# EAGLE design Alarma2022 (EAGLE 7.2.0)
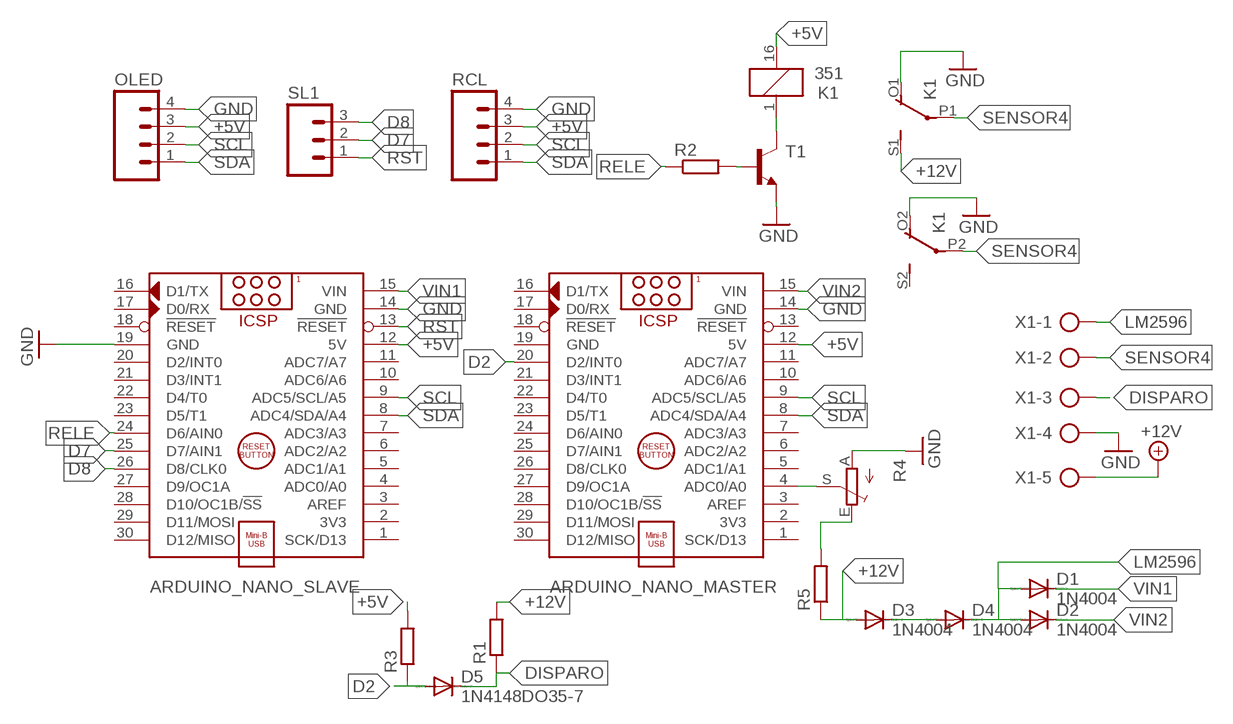
[diagram p0: schematic, sheet 1]

## Parts
ARDUINO_NANO_MASTER  ARDUINO_NANO  [ARDUINO_NANO]
ARDUINO_NANO_SLAVE  ARDUINO_NANO  [ARDUINO_NANO]
D1  1N4004  [DO41-10]
D2  1N4004  [DO41-10]
D3  1N4004  [DO41-10]
D4  1N4004  [DO41-10]
D5  1N4148DO35-7  [DO35-7]
K1  351  [351]
OLED  M04  [04P]
R1  R-EU_0207/10  [0207/10]
R2  R-EU_0207/10  [0207/10]
R3  R-EU_0207/10  [0207/10]
R4  TRIM_EU-B64Y  [B64Y]
R5  R-EU_0207/7  [0207/7]
RCL  M04  [04P]
SL1  M03  [03P]
T1  BC337-NPN-TO92-CBE  [TO92-CBE]
X1  AK500/5-H  [AK500/5-H]

## Nets
+5V: ARDUINO_NANO_MASTER.12(5V) ARDUINO_NANO_SLAVE.12(5V) K1.16 OLED.3 R3.2 RCL.3
+12V: D3.A K1.S1(2:S) R1.2 R5.1 X1.5
D2: ARDUINO_NANO_MASTER.20(D2/INT0) D5.A R3.1
D7: ARDUINO_NANO_SLAVE.25(D7/AIN1) SL1.2
D8: ARDUINO_NANO_SLAVE.26(D8/CLK0) SL1.3
DISPARO: D5.C R1.1 X1.3
GND: ARDUINO_NANO_MASTER.14(GND) ARDUINO_NANO_SLAVE.14(GND) ARDUINO_NANO_SLAVE.19(GND) K1.O1(2:O) K1.O2(3:O) OLED.4 R4.A RCL.4 T1.E X1.4
LM2596: D1.A D2.A D4.C X1.1
N$1: K1.1 T1.C
N$2: R2.2 T1.B
N$3: ARDUINO_NANO_MASTER.4(ADC0/A0) R4.S
N$4: R4.E R5.2
N$7: D3.C D4.A
RELE: ARDUINO_NANO_SLAVE.24(D6/AIN0) R2.1
RST: ARDUINO_NANO_SLAVE.13(!RESET) SL1.1
SCL: ARDUINO_NANO_MASTER.9(ADC5/SCL/A5) ARDUINO_NANO_SLAVE.9(ADC5/SCL/A5) OLED.2 RCL.2
SDA: ARDUINO_NANO_MASTER.8(ADC4/SDA/A4) ARDUINO_NANO_SLAVE.8(ADC4/SDA/A4) OLED.1 RCL.1
SENSOR4: K1.P1(2:P) K1.P2(3:P) X1.2
VIN1: ARDUINO_NANO_SLAVE.15(VIN) D1.C
VIN2: ARDUINO_NANO_MASTER.15(VIN) D2.C
Unconnected: ARDUINO_NANO_MASTER.1(SCK/D13) ARDUINO_NANO_MASTER.2(3V3) ARDUINO_NANO_MASTER.3(AREF) ARDUINO_NANO_MASTER.5(ADC1/A1) ARDUINO_NANO_MASTER.6(ADC2/A2) ARDUINO_NANO_MASTER.7(ADC3/A3) ARDUINO_NANO_MASTER.10(ADC6/A6) ARDUINO_NANO_MASTER.11(ADC7/A7) ARDUINO_NANO_MASTER.13(!RESET) ARDUINO_NANO_MASTER.16(D1/TX) ARDUINO_NANO_MASTER.17(D0/RX) ARDUINO_NANO_MASTER.18(!RESET) ARDUINO_NANO_MASTER.21(D3/INT1) ARDUINO_NANO_MASTER.22(D4/T0) ARDUINO_NANO_MASTER.23(D5/T1) ARDUINO_NANO_MASTER.24(D6/AIN0) ARDUINO_NANO_MASTER.25(D7/AIN1) ARDUINO_NANO_MASTER.26(D8/CLK0) ARDUINO_NANO_MASTER.27(D9/OC1A) ARDUINO_NANO_MASTER.28(D10/OC1B/!SS) ARDUINO_NANO_MASTER.29(D11/MOSI) ARDUINO_NANO_MASTER.30(D12/MISO) ARDUINO_NANO_SLAVE.1(SCK/D13) ARDUINO_NANO_SLAVE.2(3V3) ARDUINO_NANO_SLAVE.3(AREF) ARDUINO_NANO_SLAVE.4(ADC0/A0) ARDUINO_NANO_SLAVE.5(ADC1/A1) ARDUINO_NANO_SLAVE.6(ADC2/A2) ARDUINO_NANO_SLAVE.7(ADC3/A3) ARDUINO_NANO_SLAVE.10(ADC6/A6) ARDUINO_NANO_SLAVE.11(ADC7/A7) ARDUINO_NANO_SLAVE.16(D1/TX) ARDUINO_NANO_SLAVE.17(D0/RX) ARDUINO_NANO_SLAVE.18(!RESET) ARDUINO_NANO_SLAVE.20(D2/INT0) ARDUINO_NANO_SLAVE.21(D3/INT1) ARDUINO_NANO_SLAVE.22(D4/T0) ARDUINO_NANO_SLAVE.23(D5/T1) ARDUINO_NANO_SLAVE.27(D9/OC1A) ARDUINO_NANO_SLAVE.28(D10/OC1B/!SS) ARDUINO_NANO_SLAVE.29(D11/MOSI) ARDUINO_NANO_SLAVE.30(D12/MISO) K1.S2(3:S)

## Power pins joined to a net without a drawn wire
GND: ARDUINO_NANO_MASTER.19(GND)

## Library data of the parts
ARDUINO_NANO_MASTER ARDUINO_NANO_SLAVE = ArduinoNanoV30:ARDUINO_NANO: Arduino Nano V3.0 Module Overview: The Arduino Nano is a small, complete, and breadboard-friendly board based on the ATmega328 (Arduino Nano 3.x) or ATmega168 (Arduino Nano 2.x). It has more or less the same functionality of the Arduino Duemilanove, but in a different package. It lacks only a DC power jack, and works with a Mini-B USB cable instead of a standard one. The Nano was designed and is being produced by Gravitech <http://www.gravitech.us/arna30wiatp.html>. General specifications: Item Value Microcontroller Atmel ATmega168 or ATmega328 Operating Voltage (logic level) 5 V Input Voltage (recommended) 7-12 V Input Voltage (limits) 6-20 V Digital I/O Pins 14 (of which 6 provide PWM output) Analog Input Pins 8 DC Current per I/O Pin 40 mA Flash Memory 16 KB (ATmega168) or 32 KB (ATmega328) of which 2 KB used by bootloader SRAM 1 KB (ATmega168) or 2 KB (ATmega328) EEPROM 512 bytes (ATmega168) or 1 KB (ATmega328) Clock Speed 16 MHz Dimensions (Inches) 0.73" x 1.70" Dimensions (mm) 18mm x 45mm Overall height About 9 mm (not including pins) Weigth 5 g Power: The Arduino Nano can be powered via the Mini-B USB connection, 6-20V unregulated external power supply (pin 30), or 5V regulated external power supply (pin 27). The power source is automatically selected to the highest voltage source. Memory: The ATmega168 has 16 KB of flash memory for storing code (of which 2 KB is used for the bootloader); the ATmega328 has 32 KB, (also with 2 KB used for the bootloader). The ATmega168 has 1 KB of SRAM and 512 bytes of EEPROM (which can be read and written with the EEPROM library); the ATmega328 has 2 KB of SRAM and 1 KB of EEPROM. Input and Output: Each of the 14 digital pins on the Nano can be used as an input or output, using pinMode(), digitalWrite(), and digitalRead() functions. They operate at 5 volts. Each pin can provide or receive a maximum of 40 mA and has an internal pull-up resistor (disconnected by default) of 20-50 kOhms. In addition, some pins have specialized functions. Visit Arduino - ArduinoBoardNano <https://www.arduino.cc/en/Main/ArduinoBoardNano>
D1-D4 = diode:1N4004: DIODE general purpose rectifier, 1 A
D5 = diode:1N4148: DIODE high speed (Philips)
K1 = relay:351: RELAY 2 x switch, Omron; OC_FARNELL: unknown; OC_NEWARK: unknown
OLED RCL = con-amp-quick:M04: AMP QUICK CONNECTOR; OC_FARNELL: unknown; OC_NEWARK: unknown
R1-R3 R5 = resistor:R-EU_: RESISTOR, European symbol
R4 = pot:TRIM_EU-: POTENTIOMETER
SL1 = con-amp-quick:M03: AMP QUICK CONNECTOR; OC_FARNELL: unknown; OC_NEWARK: unknown
T1 = transistor:*-NPN-: NPN Transistror BF959 corrected 2008.03.06
X1 = con-ptr500:AK500/5-H: CONNECTOR Aug. 2004 / PTR Meßtechnik: Die Bezeichnung der Serie AK505 wurde geändert. Es handelt sich hierbei um AK500 in horizontaler Ausführung.; OC_FARNELL: unknown; OC_NEWARK: unknown

## Board
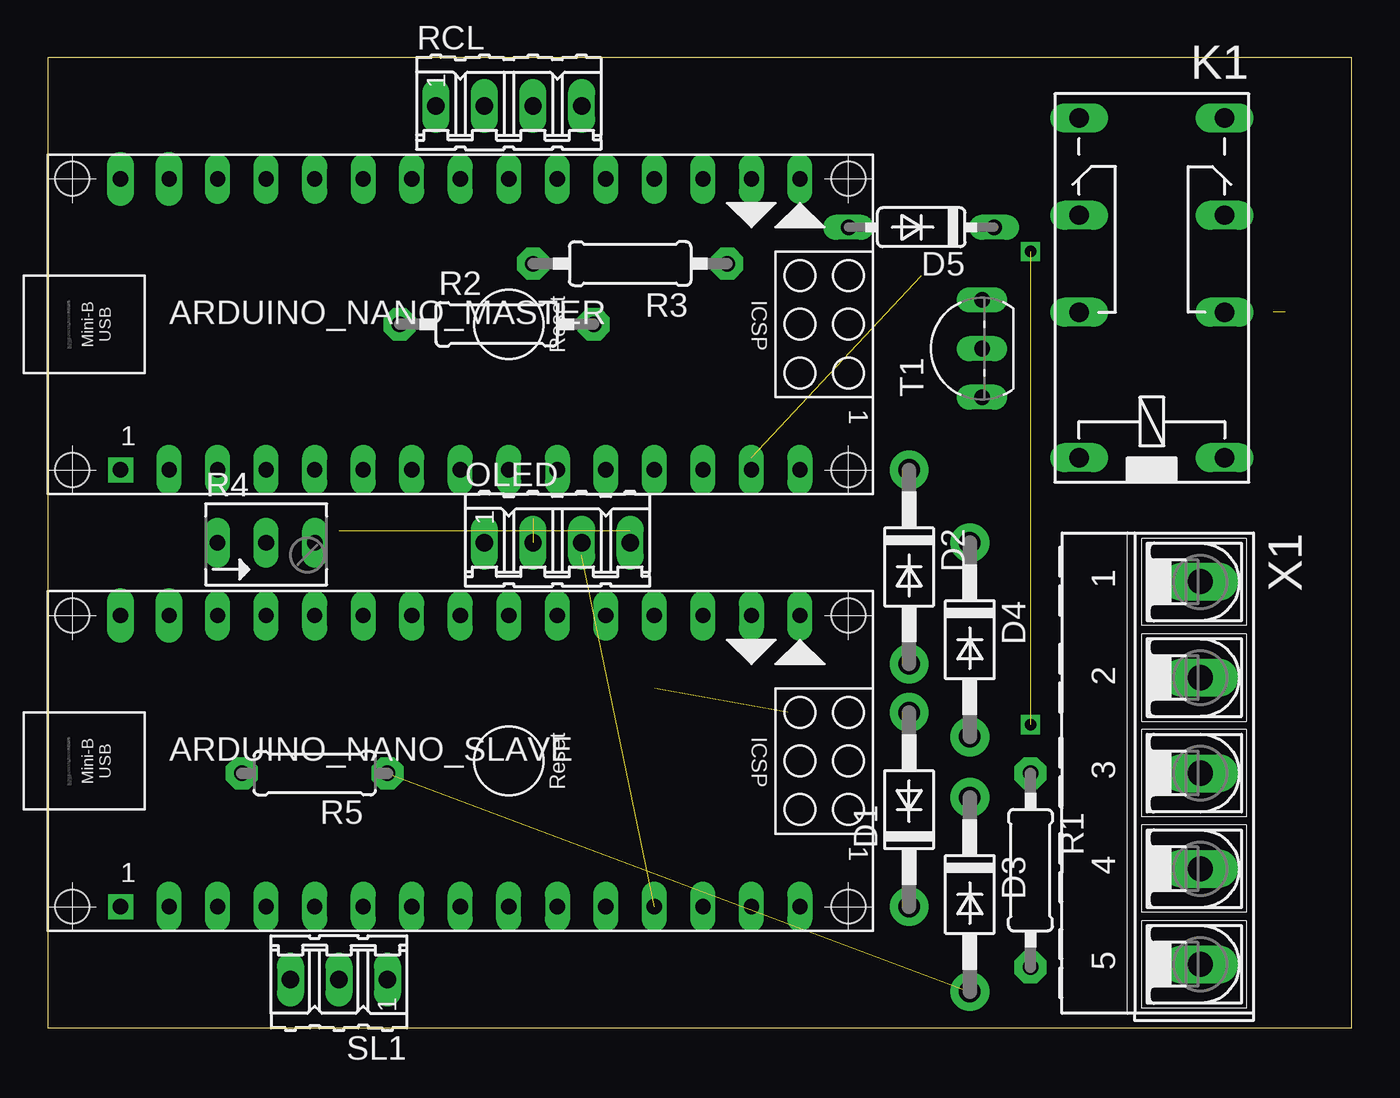
[diagram p1: board, top side]
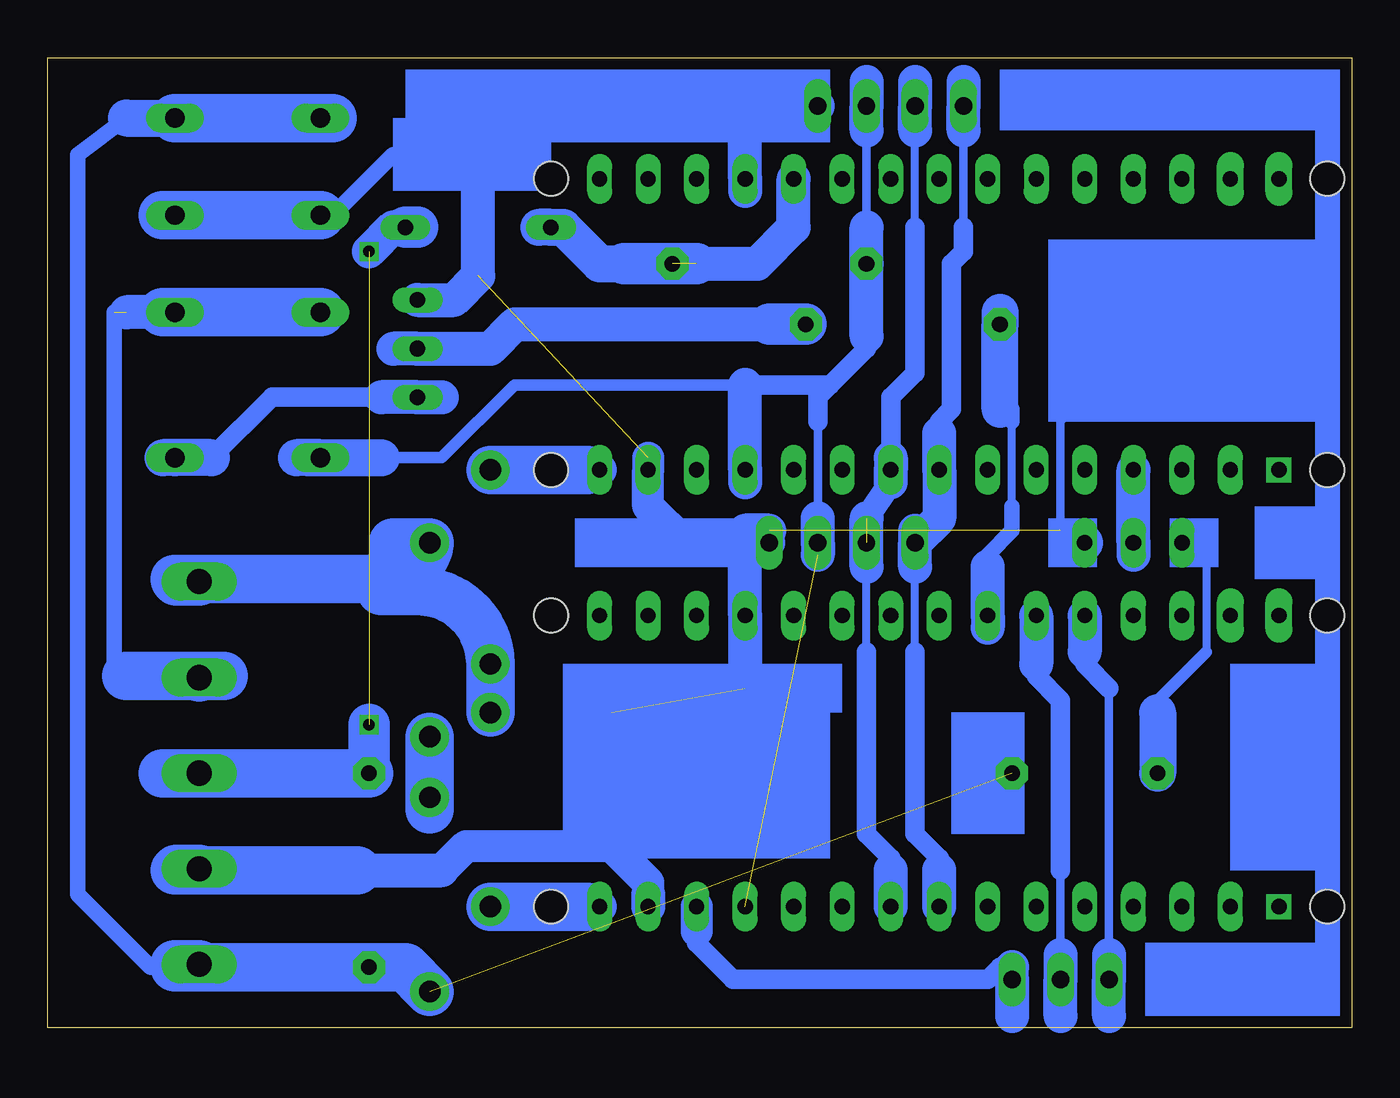
[diagram p2: board, bottom side, seen from below]

Size 68.25 x 50.79 mm. Coordinates in mm from the lower left corner, seen from the top.
Outline: 0,0 68.25,0 68.25,50.79 0,50.79 0,0
Copper layers (1*16): Top 0.035mm / dielectric 1.5mm / Bottom 0.035mm
Design rules "default": minimum track width 10mil, minimum drill 24mil, track to track 8mil, track to pad 8mil, pad to pad 8mil, via to via 8mil, smd to smd 8mil, copper to edge 40mil, drill to drill 8mil, minimum pad ring 10mil, minimum via ring 8mil, stop-mask expansion 4mil, vias tented up to drill 0mil, thermal gap 10mil

### Footprints (pad centres in the part's own frame; a part is rotated, then mirrored left to right if it is on the bottom)
ARDUINO_NANO = drill 0.8 pad 1.27 square: 1 -20.32,-7.62 | drill 0.8 long: 2 -17.78,-7.62; 3 -15.24,-7.62; 4 -12.7,-7.62; 5 -10.16,-7.62; 6 -7.62,-7.62; 7 -5.08,-7.62; 8 -2.54,-7.62; 9 0,-7.62; 10 2.54,-7.62; 11 5.08,-7.62; 12 7.62,-7.62; 13 10.16,-7.62; 14 12.7,-7.62; 15 15.24,-7.62; 16 15.24,7.62; 17 12.7,7.62; 18 10.16,7.62; 19 7.62,7.62; 20 5.08,7.62; 21 2.54,7.62; 22 0,7.62; 23 -2.54,7.62; 24 -5.08,7.62; 25 -7.62,7.62; 26 -10.16,7.62; 27 -12.7,7.62; 28 -15.24,7.62 | drill 0.8 pad 1.422 long: 29 -17.78,7.62; 30 -20.32,7.62 | hole 1.778: -22.86,-7.62; -22.86,7.62; 17.78,7.62; 17.78,-7.62
DO41-10 = drill 1.118 pad 2.032: A 5.08,0; C -5.08,0
DO35-7 = drill 0.813 long: A 3.81,0; C -3.81,0
351 = drill 1.016 long: 1 -3.81,-3.81; 16 -3.81,3.81; O1 8.89,-3.81; O2 8.89,3.81; P1 3.81,-3.81; P2 3.81,3.81; S1 13.97,-3.81; S2 13.97,3.81
04P = drill 0.914 long: 1 -3.81,0; 2 -1.27,0; 3 1.27,0; 4 3.81,0
0207/10 = drill 0.813 pad 1.676 octagon: 1 -5.08,0; 2 5.08,0
B64Y = drill 0.813 long: A 2.54,0; E -2.54,0; S 0,0
0207/7 = drill 0.813 pad 1.676 octagon: 1 -3.81,0; 2 3.81,0
03P = drill 0.914 long: 1 -2.54,0; 2 0,0; 3 2.54,0
TO92-CBE = drill 0.813 long: B 0,0; C -2.54,0; E 2.54,0
AK500/5-H = drill 1.321 long: 1 -10.033,0; 2 -5.004,0; 3 0,0; 4 5.004,0; 5 10.008,0

### Placement (x,y rotation side)
ARDUINO_NANO_MASTER  24.13,36.83 0 top
ARDUINO_NANO_SLAVE  24.13,13.97 0 top
D1  45.09,11.43 90 top
D2  45.09,24.13 270 top
D3  48.26,6.98 270 top
D4  48.26,20.32 270 top
D5  45.72,41.91 180 top
K1  57.78,33.66 90 top
OLED  26.67,25.4 0 top
R1  51.44,8.25 270 top
R2  23.5,36.83 0 top
R3  30.48,40.01 180 top
R4  11.43,25.4 0 top
R5  13.97,13.34 180 top
RCL  24.13,48.26 0 top
SL1  15.24,2.54 180 top
T1  48.9,35.56 90 top
X1  60.32,13.34 270 top

### Tracks (layer width: path | path; a pad name or v marks a point on that pad's centre or on a via)
+5V  (1 unrouted)
  Bottom 0.457: 25.4,41.91 25.4,46.99 | 27.94,26.67 27.94,31.75
  Bottom 0.61: 50.8,29.84 47.62,29.84 43.81,33.66 31.75,33.66
  Bottom 1.016: 31.75,33.66 27.3,33.66 | 27.3,33.66 25.4,35.56 25.4,36.2 | 27.94,31.75 27.94,33.02 27.3,33.66
  Bottom 1.778: 25.4,41.91 R3.2 25.4,36.2 | 25.4,46.99 RCL.3 25.4,49.53 | 27.94,24.77 OLED.3 27.94,26.67 | 31.75,28.58 ARDUINO_NANO_MASTER.12 31.75,33.66
  Bottom 1.93: 54.61,29.84 K1.16 | K1.16 55.24,29.84 | K1.16 50.8,29.84
+12V  (1 unrouted)
  Bottom 0.813: R1.2 62.87,3.18 66.68,6.98 66.68,45.72 64.13,47.62
  Bottom 1.93: 64.13,47.62 K1.S1
  Bottom 2.54: X1.5 61.6,3.33 61.6,3.18 R1.2 49.53,3.18 D3.A | 53.34,47.62 K1.S1
D2  (1 unrouted)
  Bottom 1.778: 34.29,40.01 31.12,40.01 29.21,41.91 ARDUINO_NANO_MASTER.20
  Bottom 1.93: 42.55,41.91 D5.A 41.27,41.91 39.37,40.01 38.1,40.01
  Bottom 2.184: 38.1,40.01 34.29,40.01
D7
  Bottom 0.457: 15.24,8.25 15.24,3.81
  Bottom 1.016: 16.51,19.05 16.51,18.41 15.24,17.14 15.24,8.25
  Bottom 1.778: ARDUINO_NANO_SLAVE.25 16.51,19.05 | 15.24,3.81 SL1.2 15.24,0.63
D8
  Bottom 0.457: 12.7,3.81 12.7,8.25 12.7,17.78
  Bottom 1.016: 13.97,19.68 13.97,19.05 12.7,17.78
  Bottom 1.778: ARDUINO_NANO_SLAVE.26 13.97,19.68 | 12.7,3.81 SL1.3 12.7,0.63
DISPARO  (1 unrouted)
  Bottom 1.778: D5.C 50.16,41.91 51.44,40.64
  Bottom 2.184: R1.1 51.44,15.88 | D5.C 48.9,41.91
  Bottom 2.54: 62.23,13.34 X1.3 R1.1
GND  (3 unrouted)
  Bottom 0.406: 14.61,25.4 15.24,26.04 | 15.24,31.75 14.61,32.38
  Bottom 0.457: 15.24,26.04 15.24,31.75
  Bottom 0.813: K1.O2 53.34,42.55 50.16,45.72 46.35,45.72 45.72,45.72 45.4,45.4
  Bottom 1.676: OLED.4 31.75,25.4 32.38,25.4 34.92,25.4 36.83,27.3 ARDUINO_NANO_MASTER.14 36.83,29.84 | 47.62,8.25 46.35,9.52 38.73,9.52 36.83,7.62 36.83,6.98
  Bottom 1.778: 36.83,6.98 ARDUINO_NANO_SLAVE.14 | 31.75,17.78 ARDUINO_NANO_SLAVE.19 31.75,25.4 30.48,26.04 31.75,26.04 32.38,25.4 | 31.75,43.81 ARDUINO_NANO_MASTER.19 31.75,46.99 30.48,48.26 | 30.48,48.26 RCL.4 | 45.72,45.09 45.4,45.4 42.55,48.26 30.48,48.26 | 52.07,8.25 47.62,8.25 | 38.73,9.52 38.73,16.51 | T1.E 46.99,38.1 45.72,39.37 45.72,45.09 | 45.72,45.09 46.35,45.72
  Bottom 1.93: R4.A 14.61,25.4
  Bottom 2.54: X1.4 61.52,8.33 61.6,8.25 52.07,8.25 | 62.23,42.55 K1.O1 K1.O2
LM2596
  Bottom 2.54: D1.A D2.A arc-90 48.9,22.86 50.8,22.86 arc-90 50.16,23.49 50.16,25.4 D4.C arc90 50.8,23.49 61.6,23.49 arc-90 61.47,23.37 X1.1
N$1
  Bottom 1.016: 50.8,33.02 56.52,33.02 59.69,29.84
  Bottom 1.778: 47.62,33.02 T1.C 50.8,33.02
  Bottom 1.93: 62.23,29.84 K1.1 59.69,29.84
N$2
  Bottom 1.778: 50.16,35.56 T1.B 45.09,35.56 43.81,36.83 29.84,36.83
  Bottom 2.159: 30.48,36.83 29.84,36.83 R2.2
N$3
  Bottom 1.778: 11.43,24.77 R4.S ARDUINO_NANO_MASTER.4
N$4
  Bottom 0.406: R4.E 8.25,25.4 7.62,24.77 7.62,19.68
  Bottom 0.61: 7.62,19.68 10.16,17.14 10.16,16.51
  Bottom 1.93: 10.16,16.51 R5.2
N$5  (via drill 0.6)
  other vias: 51.44,15.88
N$6  (via drill 0.6)
  other vias: 51.44,40.64
N$7
  Bottom 2.54: 48.26,11.43 D3.C D4.A
RELE
  Bottom 0.406: 17.78,27.3 17.78,31.75
  Bottom 0.813: 19.05,24.13 19.05,24.77 17.78,26.04 17.78,27.3 | 17.78,31.75 17.78,32.38 18.41,32.38
  Bottom 1.778: 19.05,20.95 ARDUINO_NANO_SLAVE.24 19.05,24.13
  Bottom 1.93: 18.41,32.38 R2.1 18.41,37.47
RST
  Bottom 1.016: 17.78,3.18 18.41,3.18 19.05,2.54 32.38,2.54 34.29,4.45 ARDUINO_NANO_SLAVE.13
  Bottom 1.676: ARDUINO_NANO_SLAVE.13 34.29,5.08
  Bottom 1.778: 17.78,0.63 SL1.1 17.78,3.18
SCL  (1 unrouted)
  Bottom 0.406: 25.4,19.68 25.4,24.13 | 22.86,41.91 22.86,46.99
  Bottom 1.016: 24.13,8.25 24.13,8.89 25.4,10.16 25.4,19.68 | 24.13,29.84 24.13,33.02 22.86,34.29 22.86,41.91
  Bottom 1.27: 25.4,26.67 24.13,28.58
  Bottom 1.778: ARDUINO_NANO_SLAVE.9 24.13,8.25 | 25.4,24.13 25.4,26.67 | 24.13,28.58 ARDUINO_NANO_MASTER.9 24.13,29.84 | 22.86,46.99 RCL.2 22.86,49.53
SDA
  Bottom 0.406: 22.86,19.68 22.86,24.13
  Bottom 0.457: 20.32,41.91 20.32,46.99
  Bottom 1.016: 21.59,8.25 21.59,8.89 22.86,10.16 22.86,19.68 | 21.59,31.12 21.59,31.75 20.95,32.38 20.95,40.01 20.32,40.64 20.32,41.91
  Bottom 1.778: ARDUINO_NANO_SLAVE.8 21.59,8.25 | 22.86,24.13 OLED.1 | 22.86,26.04 OLED.1 | OLED.1 21.59,26.67 ARDUINO_NANO_MASTER.8 21.59,31.12 | 20.32,49.53 RCL.1 20.32,46.99
SENSOR4  (1 unrouted)
  Bottom 0.813: 64.77,37.47 64.77,19.05 64.13,18.41
  Bottom 1.778: K1.P1 62.23,37.47 64.13,37.47
  Bottom 1.93: K1.P1 60.32,37.47
  Bottom 2.54: 64.13,18.41 60.25,18.41 | 59.05,18.41 60.25,18.41 | 60.25,18.41 X1.2 | K1.P2 62.23,37.47
VIN1
  Bottom 1.778: 40.01,6.35 ARDUINO_NANO_SLAVE.15
  Bottom 2.54: D1.C 40.01,6.35
VIN2
  Bottom 1.778: 40.01,29.21 ARDUINO_NANO_MASTER.15
  Bottom 2.54: D2.C 40.01,29.21
(copper drawn outside any net)
  shapes: Bottom area x23